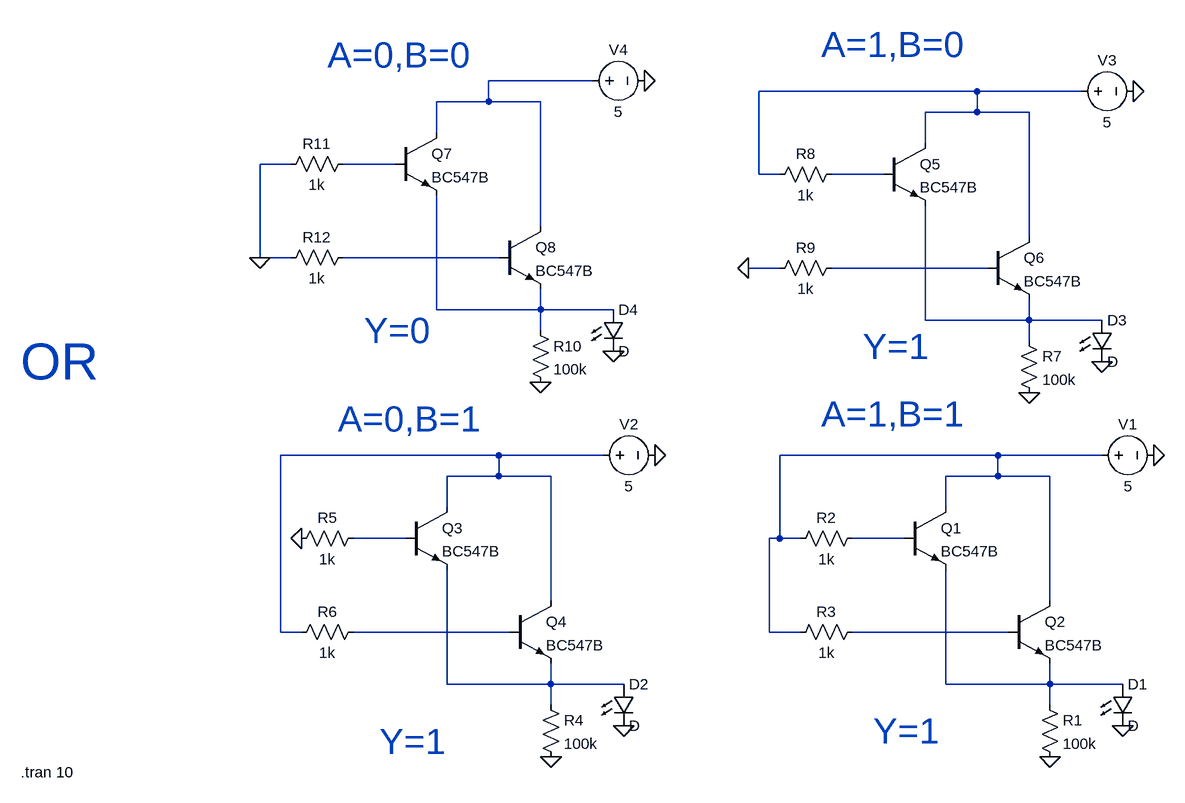
[diagram p0: schematic OrGate.asc]
OrGate.asc, the LTspice schematic file:
Version 4.1
SHEET 1 880 680
WIRE -464 -768 -624 -768
WIRE 128 -752 -208 -752
WIRE 288 -752 128 -752
WIRE -624 -736 -624 -768
WIRE -624 -736 -704 -736
WIRE -544 -736 -624 -736
WIRE 128 -720 128 -752
WIRE 128 -720 48 -720
WIRE 208 -720 128 -720
WIRE -704 -688 -704 -736
WIRE 48 -672 48 -720
WIRE -928 -640 -976 -640
WIRE -768 -640 -848 -640
WIRE -208 -624 -208 -752
WIRE -176 -624 -208 -624
WIRE -16 -624 -96 -624
WIRE -544 -544 -544 -736
WIRE 208 -528 208 -720
WIRE -976 -496 -976 -640
WIRE -928 -496 -976 -496
WIRE -608 -496 -848 -496
WIRE -176 -480 -224 -480
WIRE 144 -480 -96 -480
WIRE -704 -416 -704 -592
WIRE -544 -416 -544 -448
WIRE -544 -416 -704 -416
WIRE -432 -416 -544 -416
WIRE 48 -400 48 -576
WIRE 208 -400 208 -432
WIRE 208 -400 48 -400
WIRE 320 -400 208 -400
WIRE -544 -384 -544 -416
WIRE 208 -368 208 -400
WIRE -608 -192 -944 -192
WIRE -448 -192 -608 -192
WIRE 160 -192 -176 -192
WIRE 320 -192 160 -192
WIRE -608 -160 -608 -192
WIRE -608 -160 -688 -160
WIRE -528 -160 -608 -160
WIRE 160 -160 160 -192
WIRE 160 -160 80 -160
WIRE 240 -160 160 -160
WIRE -688 -112 -688 -160
WIRE 80 -112 80 -160
WIRE -752 -64 -832 -64
WIRE -176 -64 -176 -192
WIRE -176 -64 -192 -64
WIRE -144 -64 -176 -64
WIRE 16 -64 -64 -64
WIRE -528 32 -528 -160
WIRE 240 32 240 -160
WIRE -944 80 -944 -192
WIRE -912 80 -944 80
WIRE -592 80 -832 80
WIRE -192 80 -192 -64
WIRE -144 80 -192 80
WIRE 176 80 -64 80
WIRE -688 160 -688 -16
WIRE -528 160 -528 128
WIRE -528 160 -688 160
WIRE -416 160 -528 160
WIRE 80 160 80 -16
WIRE 240 160 240 128
WIRE 240 160 80 160
WIRE 352 160 240 160
WIRE -528 192 -528 160
WIRE 240 192 240 160
FLAG 240 272 0
FLAG 352 224 0
FLAG 400 -192 0
FLAG -528 272 0
FLAG -416 224 0
FLAG -368 -192 0
FLAG 208 -288 0
FLAG 320 -336 0
FLAG 368 -752 0
FLAG -544 -304 0
FLAG -432 -352 0
FLAG -384 -768 0
FLAG -976 -496 0
FLAG -224 -480 0
FLAG -912 -64 0
SYMBOL LED 336 160 R0
SYMATTR InstName D1
SYMBOL npn 16 -112 R0
SYMATTR InstName Q1
SYMATTR Value BC547B
SYMBOL npn 176 32 R0
SYMATTR InstName Q2
SYMATTR Value BC547B
SYMBOL res 224 176 R0
SYMATTR InstName R1
SYMATTR Value 100k
SYMBOL res -48 -80 R90
WINDOW 0 0 56 VBottom 2
WINDOW 3 32 56 VTop 2
SYMATTR InstName R2
SYMATTR Value 1k
SYMBOL res -48 64 R90
WINDOW 0 0 56 VBottom 2
WINDOW 3 32 56 VTop 2
SYMATTR InstName R3
SYMATTR Value 1k
SYMBOL voltage 304 -192 M90
WINDOW 0 -32 56 VBottom 2
WINDOW 3 32 56 VTop 2
WINDOW 123 0 0 Left 0
WINDOW 39 0 0 Left 0
SYMATTR InstName V1
SYMATTR Value 5
SYMBOL LED -432 160 R0
SYMATTR InstName D2
SYMBOL npn -752 -112 R0
SYMATTR InstName Q3
SYMATTR Value BC547B
SYMBOL npn -592 32 R0
SYMATTR InstName Q4
SYMATTR Value BC547B
SYMBOL res -544 176 R0
SYMATTR InstName R4
SYMATTR Value 100k
SYMBOL res -816 -80 R90
WINDOW 0 0 56 VBottom 2
WINDOW 3 32 56 VTop 2
SYMATTR InstName R5
SYMATTR Value 1k
SYMBOL res -816 64 R90
WINDOW 0 0 56 VBottom 2
WINDOW 3 32 56 VTop 2
SYMATTR InstName R6
SYMATTR Value 1k
SYMBOL voltage -464 -192 M90
WINDOW 0 -32 56 VBottom 2
WINDOW 3 32 56 VTop 2
WINDOW 123 0 0 Left 0
WINDOW 39 0 0 Left 0
SYMATTR InstName V2
SYMATTR Value 5
SYMBOL LED 304 -400 R0
SYMATTR InstName D3
SYMBOL npn -16 -672 R0
SYMATTR InstName Q5
SYMATTR Value BC547B
SYMBOL npn 144 -528 R0
SYMATTR InstName Q6
SYMATTR Value BC547B
SYMBOL res 192 -384 R0
SYMATTR InstName R7
SYMATTR Value 100k
SYMBOL res -80 -640 R90
WINDOW 0 0 56 VBottom 2
WINDOW 3 32 56 VTop 2
SYMATTR InstName R8
SYMATTR Value 1k
SYMBOL res -80 -496 R90
WINDOW 0 0 56 VBottom 2
WINDOW 3 32 56 VTop 2
SYMATTR InstName R9
SYMATTR Value 1k
SYMBOL voltage 272 -752 M90
WINDOW 0 -32 56 VBottom 2
WINDOW 3 32 56 VTop 2
WINDOW 123 0 0 Left 0
WINDOW 39 0 0 Left 0
SYMATTR InstName V3
SYMATTR Value 5
SYMBOL LED -448 -416 R0
SYMATTR InstName D4
SYMBOL npn -768 -688 R0
SYMATTR InstName Q7
SYMATTR Value BC547B
SYMBOL npn -608 -544 R0
SYMATTR InstName Q8
SYMATTR Value BC547B
SYMBOL res -560 -400 R0
SYMATTR InstName R10
SYMATTR Value 100k
SYMBOL res -832 -656 R90
WINDOW 0 0 56 VBottom 2
WINDOW 3 32 56 VTop 2
SYMATTR InstName R11
SYMATTR Value 1k
SYMBOL res -832 -512 R90
WINDOW 0 0 56 VBottom 2
WINDOW 3 32 56 VTop 2
SYMATTR InstName R12
SYMATTR Value 1k
SYMBOL voltage -480 -768 M90
WINDOW 0 -32 56 VBottom 2
WINDOW 3 32 56 VTop 2
WINDOW 123 0 0 Left 0
WINDOW 39 0 0 Left 0
SYMATTR InstName V4
SYMATTR Value 5
TEXT -872 -808 Left 5 ;A=0,B=0
TEXT -112 -824 Left 5 ;A=1,B=0
TEXT -856 -248 Left 5 ;A=0,B=1
TEXT -112 -256 Left 5 ;A=1,B=1
TEXT -48 -360 Left 5 ;Y=1
TEXT -32 232 Left 5 ;Y=1
TEXT -792 248 Left 5 ;Y=1
TEXT -816 -384 Left 5 ;Y=0
TEXT -1344 -336 Left 6 ;OR
TEXT -1344 296 Left 2 !.tran 10

The netlist it stands for:
* OrGate.asc
D1 N016 0 D
Q1 N010 N012 N016 0 BC547B
Q2 N010 N014 N016 0 BC547B
R1 N016 0 100k
R2 N012 N010 1k
R3 N014 N010 1k
V1 N010 0 5
D2 N015 0 D
Q3 N009 N011 N015 0 BC547B
Q4 N009 N013 N015 0 BC547B
R4 N015 0 100k
R5 N011 0 1k
R6 N013 N009 1k
V2 N009 0 5
D3 N008 0 D
Q5 N002 N004 N008 0 BC547B
Q6 N002 N006 N008 0 BC547B
R7 N008 0 100k
R8 N004 N002 1k
R9 N006 0 1k
V3 N002 0 5
D4 N007 0 D
Q7 N001 N003 N007 0 BC547B
Q8 N001 N005 N007 0 BC547B
R10 N007 0 100k
R11 N003 0 1k
R12 N005 0 1k
V4 N001 0 5
.model D D
.lib standard.dio
.model NPN NPN
.model PNP PNP
.lib standard.bjt
* A=0,B=0
* A=1,B=0
* A=0,B=1
* A=1,B=1
* Y=1
* Y=1
* Y=1
* Y=0
* OR
.tran 10
.backanno
.end